# EAGLE design Driver (EAGLE 8.3.0)
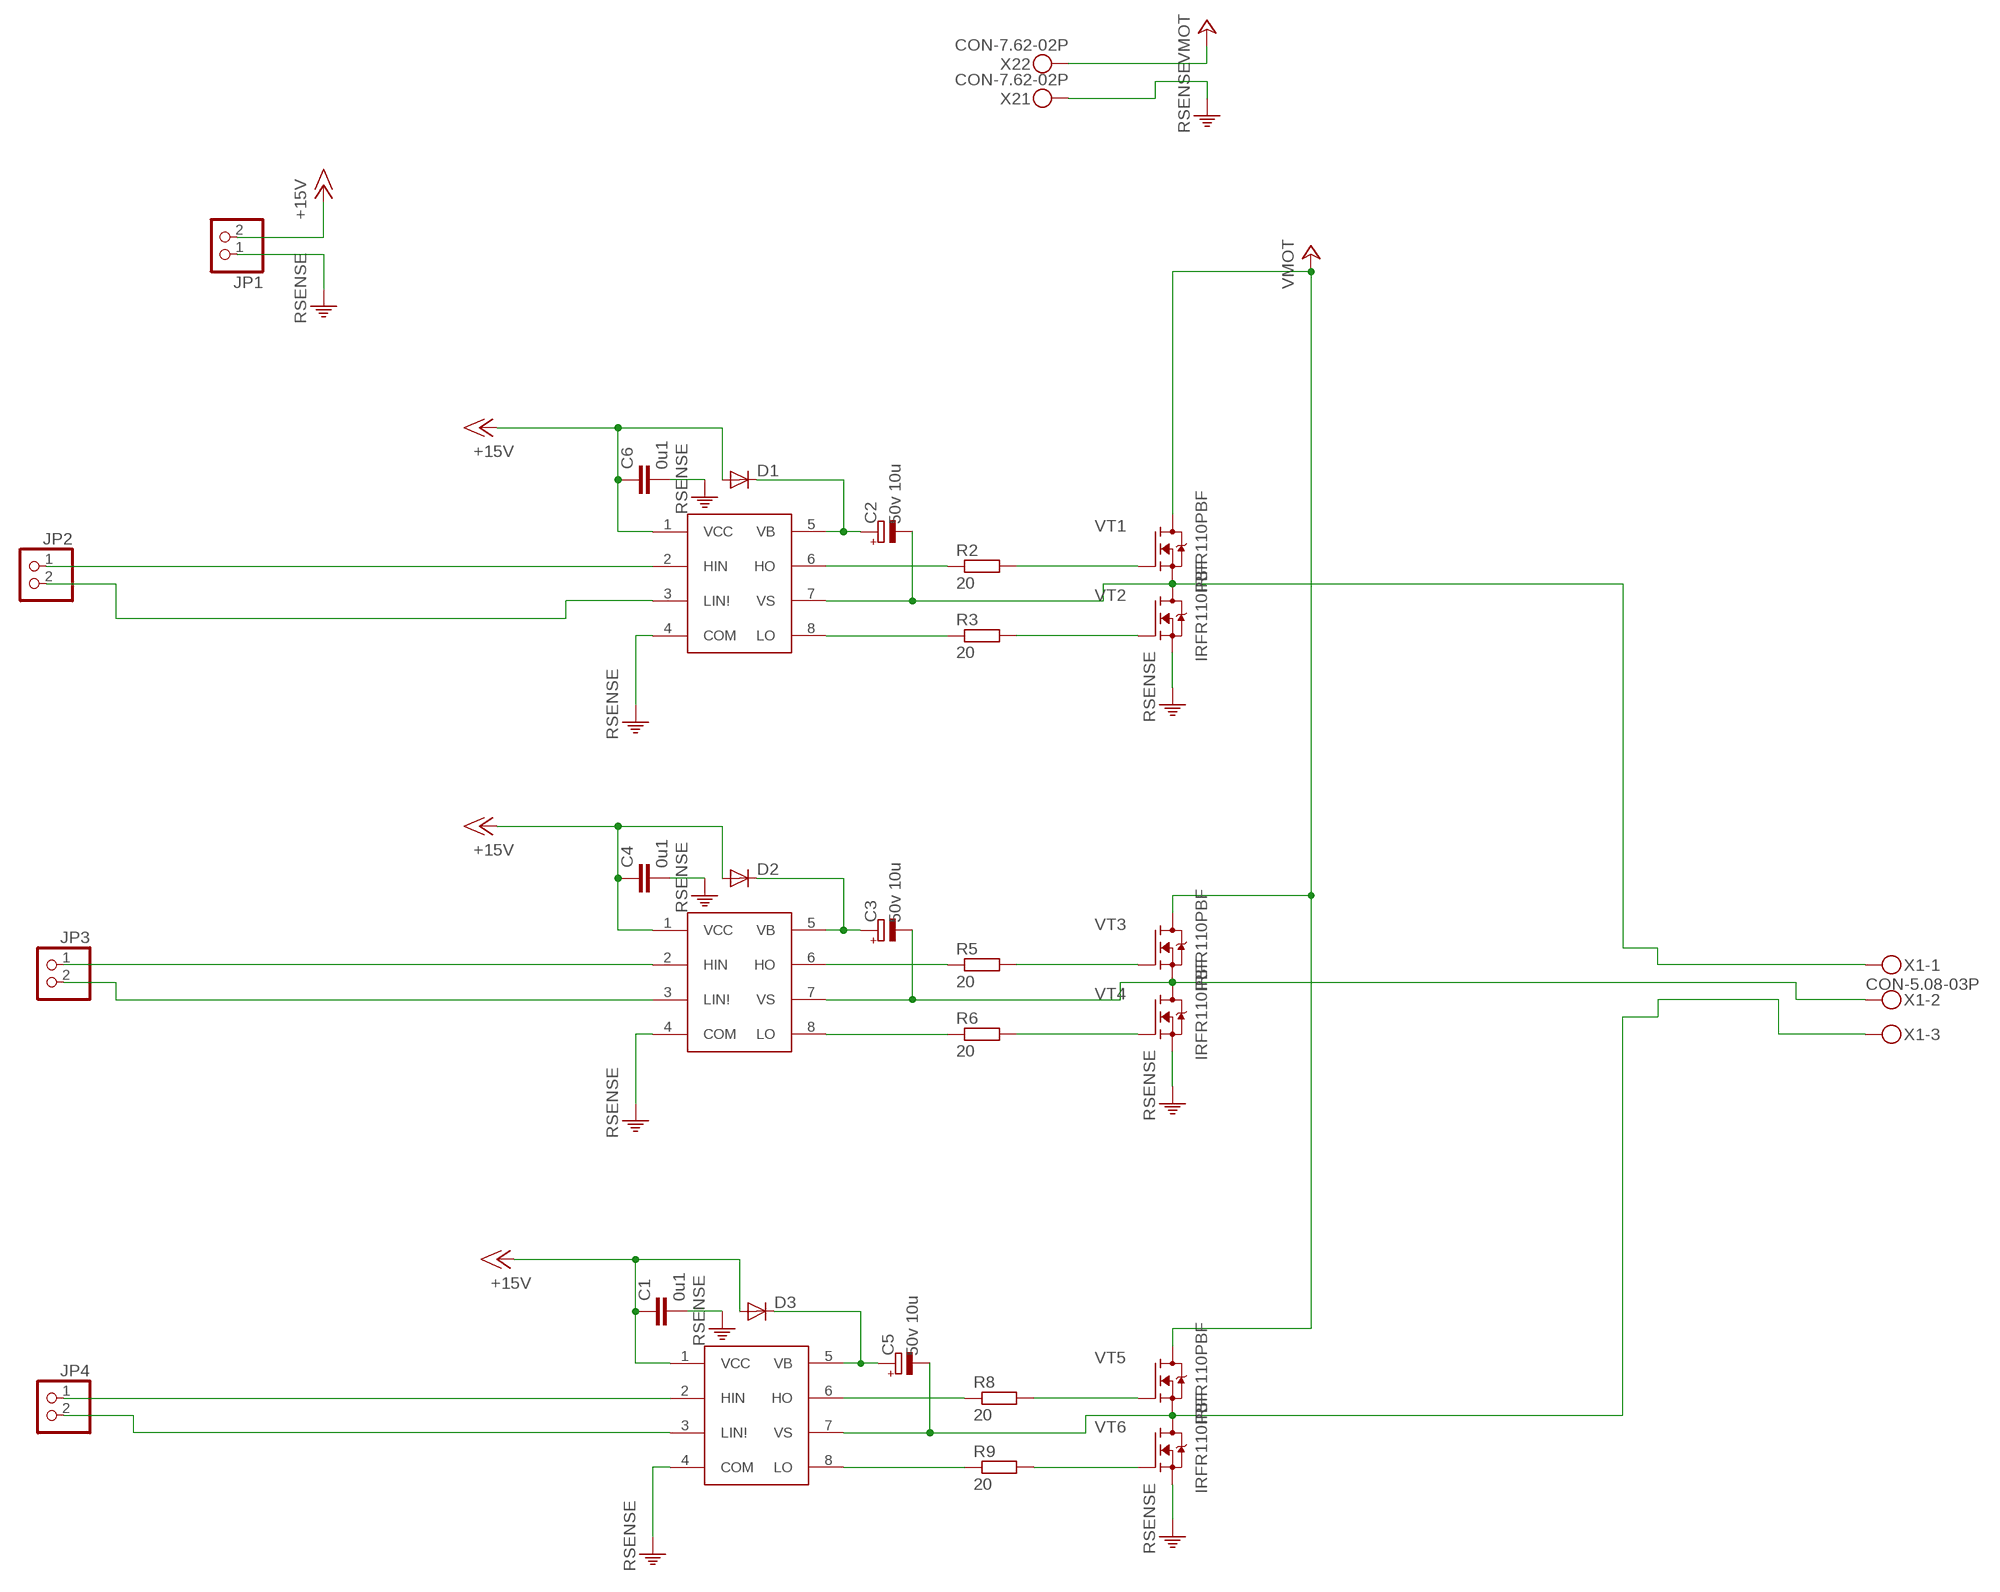
[diagram p0: schematic, sheet 1]

## Parts
C1  0u1  CAP_0805  [C0805]
C2  50v 10u  CAP-POL_E2.5-7  [E2,5-7]
C3  50v 10u  CAP-POL_E2.5-7  [E2,5-7]
C4  0u1  CAP_0805  [C0805]
C5  50v 10u  CAP-POL_E2.5-7  [E2,5-7]
C6  0u1  CAP_0805  [C0805]
D1  DIODE_ES1J  [DO214AC]
D2  DIODE_ES1J  [DO214AC]
D3  DIODE_ES1J  [DO214AC]
IC-1  IC-IR2103  [SO8]
IC-2  IC-IR2103  [SO8]
IC-3  IC-IR2103  [SO8]
JP1  PINHD-1X2  [1X02]
JP2  PINHD-1X2  [1X02]
JP3  PINHD-1X2  [1X02]
JP4  PINHD-1X2  [1X02]
R2  20  R_0805  [R0805]
R3  20  R_0805  [R0805]
R5  20  R_0805  [R0805]
R6  20  R_0805  [R0805]
R8  20  R_0805  [R0805]
R9  20  R_0805  [R0805]
VT1  IRFR110PBF  FET-NDPAK  [DPAK]
VT2  IRFR110PBF  FET-NDPAK  [DPAK]
VT3  IRFR110PBF  FET-NDPAK  [DPAK]
VT4  IRFR110PBF  FET-NDPAK  [DPAK]
VT5  IRFR110PBF  FET-NDPAK  [DPAK]
VT6  IRFR110PBF  FET-NDPAK  [DPAK]
X1  CON-5.08-03P  [MKDSN1,5/3-5,08]
X2  CON-7.62-02P  [KF25C-7.62-02P-13]

## Nets
+15V: C1.1 C4.1 C6.1 D1.A D2.A D3.A IC-1.1(VCC) IC-2.1(VCC) IC-3.1(VCC) JP1.2
+24V: VT1.D VT3.D VT5.D X2.P$2 ; supply symbol labelled VMOT
N$1: C2.- IC-1.7(VS) VT1.S VT2.D X1.1
N$2: C2.+ D1.C IC-1.5(VB)
N$3: IC-1.2(HIN) JP2.1
N$4: IC-1.3(LIN!) JP2.2
N$5: IC-1.8(LO) R3.1
N$6: IC-1.6(HO) R2.1
N$7: C3.- IC-2.7(VS) VT3.S VT4.D X1.2
N$8: C3.+ D2.C IC-2.5(VB)
N$9: IC-2.2(HIN) JP3.1
N$10: IC-2.3(LIN!) JP3.2
N$11: IC-2.8(LO) R6.1
N$12: IC-2.6(HO) R5.1
N$13: C5.- IC-3.7(VS) VT5.S VT6.D X1.3
N$14: C5.+ D3.C IC-3.5(VB)
N$15: IC-3.2(HIN) JP4.1
N$16: IC-3.3(LIN!) JP4.2
N$17: IC-3.8(LO) R9.1
N$18: IC-3.6(HO) R8.1
N$27: R9.2 VT6.G
N$28: R8.2 VT5.G
N$29: R5.2 VT3.G
N$30: R6.2 VT4.G
N$31: R3.2 VT2.G
N$32: R2.2 VT1.G
RSENSE: C1.2 C4.2 C6.2 IC-1.4(COM) IC-2.4(COM) IC-3.4(COM) JP1.1 VT2.S VT4.S VT6.S X2.P$1

## Library data of the parts
C1 C4 C6 = Namenlos:CAP_
C2 C3 C5 = Namenlos:CAP-POL_
D1-D3 = Namenlos:DIODE_
IC-1-IC-3 = Namenlos:IC-IR2103
JP1-JP4 = pinhead:PINHD-1X2: PIN HEADER
R2 R3 R5 R6 R8 R9 = Namenlos:R_
VT1-VT6 = Namenlos:FET-N
X1 = Namenlos:CON-5.08-03P: MKDSN 1,5/ 3-5,08 Printklemme Nennstrom: 13,5 A Nennspannung: 250 V Rastermaß: 5,08 mm Polzahl: 3 Anschlussart: Schraubanschluss Montage: Löten Anschlussrichtung Leiter/Platine: 0 ° Artikelnummer: 1729131 Source: http://eshop.phoenixcontact.com .. 1729131.pdf
X2 = Namenlos:CON-7.62-02P

## Board
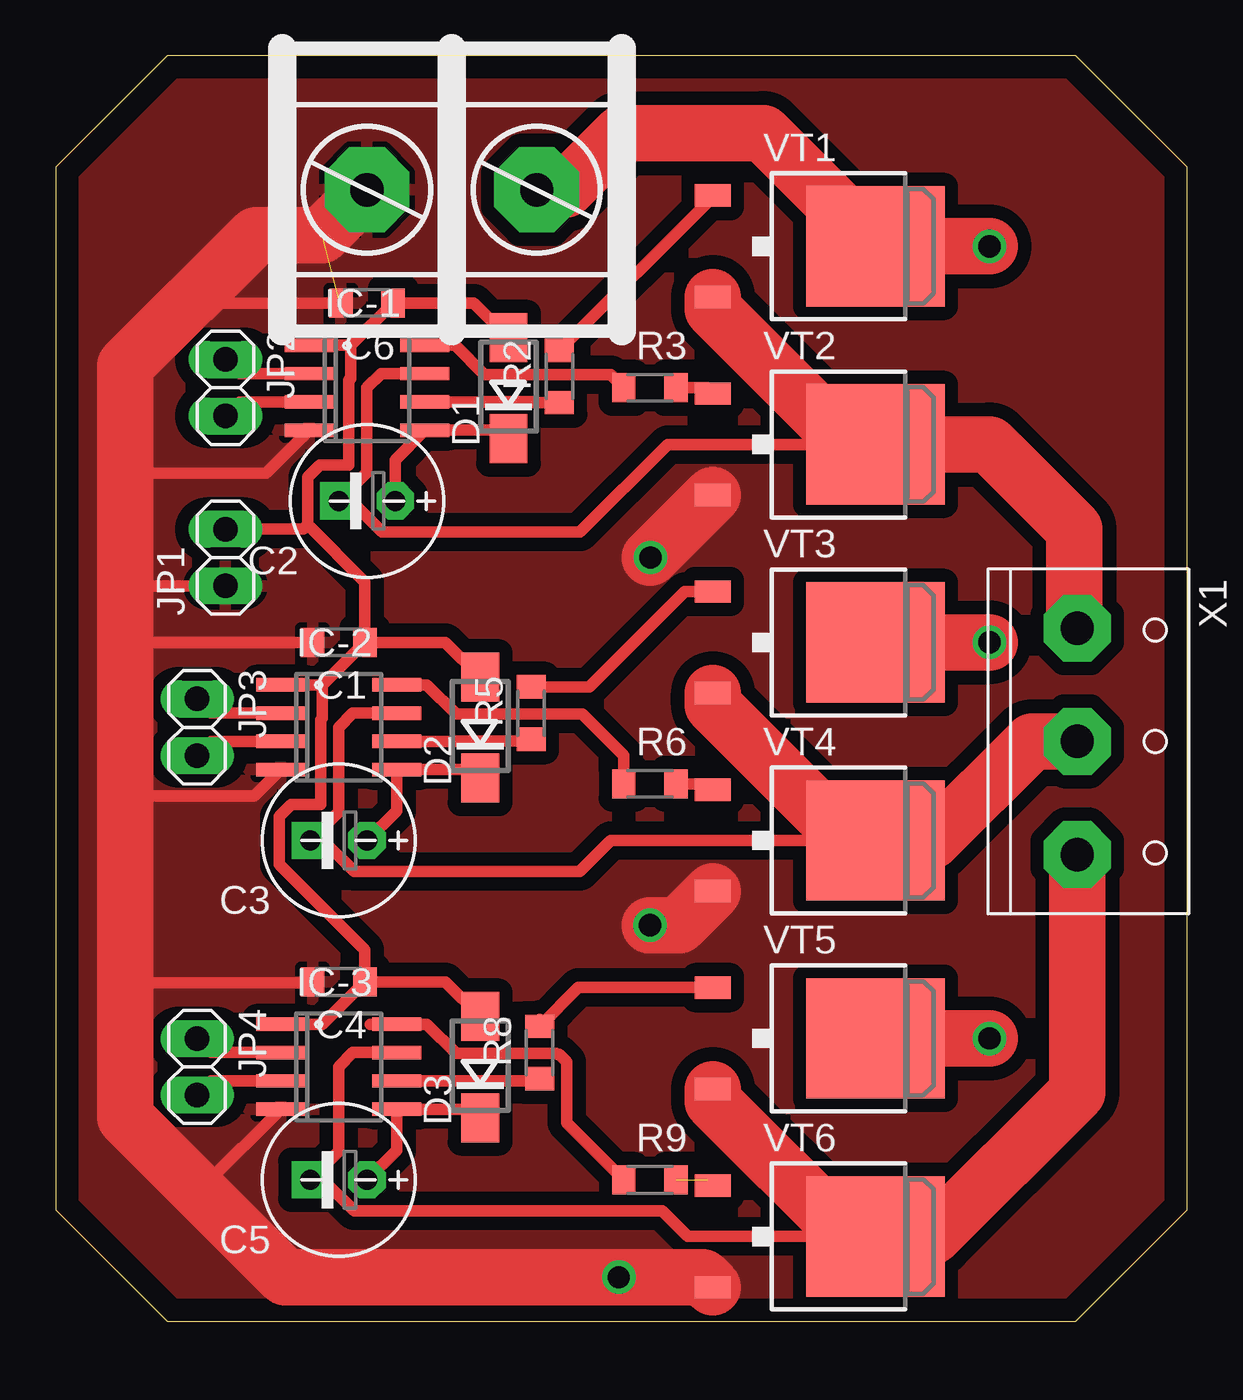
[diagram p1: board, top side]
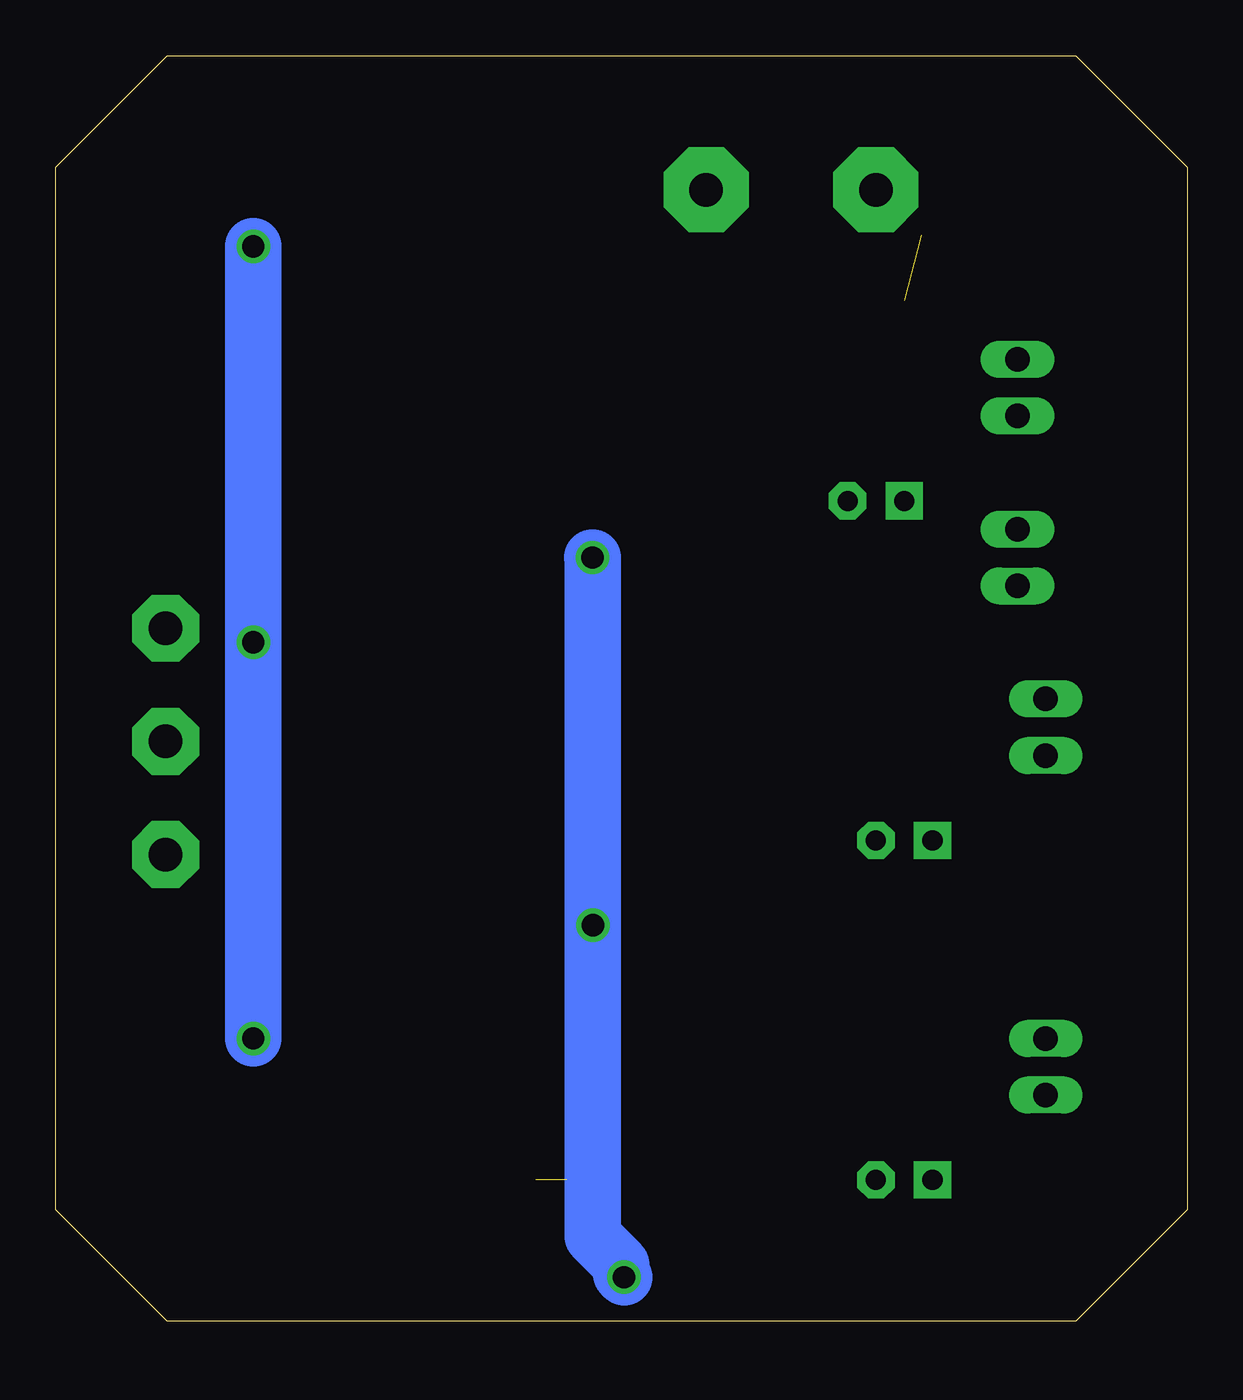
[diagram p2: board, bottom side, seen from below]

Size 50.78 x 56.82 mm. Coordinates in mm from the lower left corner, seen from the top.
Outline: 45.78,56.82 5,56.82 0,51.82 0,5 5,0 45.78,0 50.78,5 50.78,51.82 45.78,56.82
Copper layers (1*16): Top 0.035mm / dielectric 1.5mm / Bottom 0.035mm
Design rules "default *": minimum track width 6mil, minimum drill 0.35mm, track to track 12mil, track to pad 12mil, pad to pad 12mil, via to via 12mil, smd to smd 12mil, copper to edge 40mil, drill to drill 6mil, minimum pad ring 10mil, minimum via ring 8mil, stop-mask expansion 4mil, vias tented up to drill 0mil, thermal gap 10mil

### Footprints (pad centres in the part's own frame; a part is rotated, then mirrored left to right if it is on the bottom)
C0805 = smd 1.05 x 1.3: 1 -1.175,0; 2 1.175,0
E2,5-7 = drill 0.9 pad 1.676 octagon: + -1.27,0 | drill 0.9 pad 1.676 square: - 1.27,0
DO214AC = smd 2.2 x 1.7: A 2.25,0; C -2.285,0
SO8 = smd 0.6 x 2.2: 1 -1.905,-2.6; 2 -0.635,-2.6; 3 0.635,-2.6; 4 1.905,-2.6; 5 1.905,2.6; 6 0.635,2.6; 7 -0.635,2.6; 8 -1.905,2.6
1X02 = drill 1.1 long: 1 -1.27,0; 2 1.27,0
R0805 = smd 1.05 x 1.3: 1 -1.175,0; 2 1.175,0
DPAK = smd 5.4 x 6.2: D 0,2.5 | smd 1 x 1.6: G -2.28,-4.8; S 2.28,-4.8
MKDSN1,5/3-5,08 = drill 1.5 pad 3 octagon: 1 -5.08,0; 2 0,0; 3 5.08,0
KF25C-7.62-02P-13 = drill 1.5 pad 3.81 octagon: P$1 -3.81,0; P$2 3.81,0

### Placement (x,y rotation side)
C1  12.7,30.48 180 top
C2  13.97,36.83 180 top
C3  12.7,21.59 180 top
C4  12.7,15.24 180 top
C5  12.7,6.35 180 top
C6  13.97,45.72 180 top
D1  20.32,41.91 90 top
D2  19.05,26.67 90 top
D3  19.05,11.43 90 top
IC-1  13.97,41.91 270 top
IC-2  12.7,26.67 270 top
IC-3  12.7,11.43 270 top
JP1  7.62,34.29 90 top
JP2  7.62,41.91 270 top
JP3  6.35,26.67 270 top
JP4  6.35,11.43 270 top
R2  22.61,42.42 90 top
R3  26.67,41.91 0 top
R5  21.34,27.31 90 top
R6  26.67,24.13 0 top
R8  21.72,12.07 90 top
R9  26.67,6.35 0 top
VT1  34.29,48.26 270 top
VT2  34.29,39.37 270 top
VT3  34.29,30.48 270 top
VT4  34.29,21.59 270 top
VT5  34.29,12.7 270 top
VT6  34.29,3.81 270 top
X1  45.85,26.04 270 top
X2  17.78,50.8 0 top

### Tracks (layer width: path | path; a pad name or v marks a point on that pad's centre or on a via)
+15V
  Top 0.508: C6.1 18.76,45.72 D1.A | C1.1 17.49,30.48 D2.A | C4.1 17.49,15.24 D3.A | 11.97,28.57 IC-2.1 | 11.97,28.57 C1.1 | IC-3.1 11.97,13.34 C4.1 | 11.97,28.57 11.97,27.09 11.89,27.01 11.89,23.2 10.57,23.2 10.03,22.66 10.03,20.52 13.88,16.68 C4.1 | 13.24,43.81 IC-1.1 | 13.24,43.81 C6.1 | 11.3,35.76 11.3,37.9 11.84,38.44 13.16,38.44 13.16,42.25 13.24,42.33 13.24,43.81 | 11.3,35.76 13.88,33.19 C1.1 | 15.24,45.81 C6.1 | JP1.2 11.1,35.56 11.3,35.76
+24V  (via drill 1)
  Top 2.54: VT3.D v41.91,30.48 | VT5.D v41.91,12.7 | 36.83,48.26 v41.91,48.26 | 36.83,48.26 VT1.D | X2.P$2 22.86,50.8 25.4,53.34 31.75,53.34 36.83,48.26
  Bottom 2.54: v41.91,12.7 v41.91,30.48 v41.91,48.26
N$1
  Top 0.508: IC-1.7 14.61,42.55 13.97,41.91 13.97,38.1 C2.- 13.26,36.83 14.66,35.43 23.52,35.43 27.46,39.37 36.83,39.37
  Top 2.54: VT1.S 29.49,45.44 35.56,39.37 VT2.D 36.83,39.37 41.91,39.37 45.72,35.56 45.72,31.24 X1.1
N$2
  Top 0.508: C2.+ 15.24,38.67 IC-1.5 19.94,40 D1.C
N$3
  Top 0.508: IC-1.2 8.26,42.55 JP2.1
N$4
  Top 0.508: IC-1.3 8.26,41.28 JP2.2
N$5
  Top 0.508: IC-1.8 17.93,43.81 19.24,42.5 23.32,42.5 | 23.32,42.5 | R3.1 24.9,42.5 23.32,42.5
N$6
  Top 0.508: R2.1 21.44,41.24 21.4,41.28 19.24,41.28 19.23,41.28 IC-1.6
N$7
  Top 0.508: IC-2.7 13.34,27.31 12.7,26.67 12.7,22.86 C3.- 11.99,21.59 13.39,20.19 23.52,20.19 24.92,21.59 35.56,21.59
  Top 2.54: VT3.S 29.49,27.66 35.56,21.59 VT4.D 39.37,21.59 43.82,26.04 X1.2
N$8
  Top 0.508: C3.+ 15.3,22.92 IC-2.5 18.67,24.76 D2.C
N$9
  Top 0.508: IC-2.2 6.98,27.31 JP3.1
N$10
  Top 0.508: IC-2.3 6.98,26.04 JP3.2
N$11
  Top 0.508: IC-2.8 16.66,28.57 17.97,27.26 23.63,27.26 25.49,25.4 R6.1
N$12
  Top 0.508: IC-2.6 17.96,26.04 17.97,26.04 21.25,26.04 R5.1
N$13
  Top 0.508: IC-3.7 13.34,12.07 12.7,11.43 12.7,7.62 C5.- 11.99,6.35 13.39,4.95 27.22,4.95 28.36,3.81 VT6.D
  Top 2.54: VT5.S 29.49,9.88 35.56,3.81 VT6.D 39.37,3.81 45.85,10.29 X1.3
N$14
  Top 0.508: C5.+ 15.3,7.68 IC-3.5 18.67,9.52 D3.C
N$15
  Top 0.508: IC-3.2 6.98,12.07 JP4.1
N$16
  Top 0.508: IC-3.3 6.98,10.79 JP4.2
N$17
  Top 0.508: 14.12,13.34 IC-3.8 16.66,13.34 17.97,12.02 22.46,12.02 22.51,11.97 22.6,11.97 22.93,11.65 22.93,8.92 R9.1
N$18
  Top 0.508: IC-3.6 17.96,10.79 17.97,10.8 21.63,10.8 R8.1
N$27  (1 unrouted)
  Top 0.508: 29.23,6.35 VT6.G
N$28
  Top 0.508: 21.72,13.56 R8.2 23.46,14.98 VT5.G
N$29
  Top 0.508: R5.2 23.94,28.48 28.22,32.76 VT3.G
N$30
  Top 0.508: R6.2 29.23,24.13 VT4.G
N$31
  Top 0.508: 28.1,41.65 R3.2 29.23,41.91 VT2.G
N$32
  Top 0.508: R2.2 29.49,50.48 VT1.G
RSENSE  (via drill 1)  (1 unrouted)
  Top 0.508: 5.41,45.39 5.74,45.72 C6.2 12.7,45.81 | IC-1.4 9.44,38.08 3.12,38.08 | C1.2 3.12,30.48 | IC-2.4 8.92,23.59 3.12,23.59 | C4.2 11.47,15.18 3.12,15.18 | IC-3.4 6.72,6.14 6.72,5.57 | JP1.1 3.58,33.02 3.12,32.56
  Top 2.54: VT2.S v26.69,34.29 26.67,34.29 | VT6.S 29.04,1.98 v25.27,1.98 10.31,1.98 6.72,5.57 3.12,9.17 3.12,15.18 3.12,23.59 3.12,30.48 3.12,32.56 3.12,38.08 3.12,42.9 8.99,48.77 11.94,48.77 X2.P$1 | v26.67,17.78 27.96,17.78 VT4.S
  Bottom 2.54: v26.69,34.29 26.67,34.29 v26.67,17.78 26.67,3.81 25.4,2.54 25.4,2.11 v25.27,1.98
  pour Top (isolate 0.61): 0,52.07 5.08,57.15 45.72,57.15 50.8,52.07 50.8,5.08 45.72,0 5.08,0 0,5.08